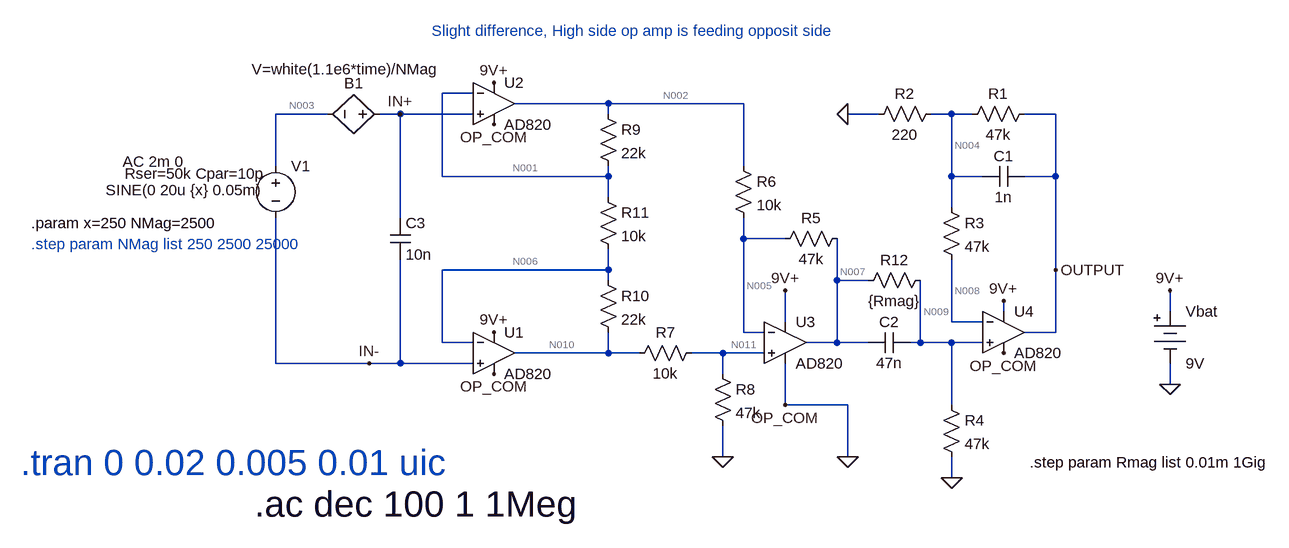
[diagram p0: schematic CornellBareReconstruction.asc]
CornellBareReconstruction.asc, the LTspice schematic file:
Version 4
SHEET 1 1252 680
WIRE -32 -384 -80 -384
WIRE 176 -368 32 -368
WIRE 384 -368 176 -368
WIRE -256 -352 -336 -352
WIRE -144 -352 -176 -352
WIRE -32 -352 -144 -352
WIRE 176 -352 176 -368
WIRE 592 -352 544 -352
WIRE 704 -352 672 -352
WIRE 736 -352 704 -352
WIRE 864 -352 816 -352
WIRE -336 -272 -336 -352
WIRE 384 -272 384 -368
WIRE -80 -256 -80 -384
WIRE 176 -256 176 -272
WIRE 176 -256 -80 -256
WIRE 704 -256 704 -352
WIRE 752 -256 704 -256
WIRE 864 -256 864 -352
WIRE 864 -256 816 -256
WIRE 176 -224 176 -256
WIRE 704 -208 704 -256
WIRE -144 -192 -144 -352
WIRE 384 -160 384 -192
WIRE 448 -160 384 -160
WIRE 176 -112 176 -144
WIRE 176 -112 -80 -112
WIRE 864 -112 864 -256
WIRE 176 -96 176 -112
WIRE 528 -96 528 -160
WIRE 576 -96 528 -96
WIRE 784 -48 784 -64
WIRE 1040 -48 1040 -80
WIRE 448 -32 448 -80
WIRE 704 -32 704 -128
WIRE 752 -32 704 -32
WIRE 384 -16 384 -160
WIRE 416 -16 384 -16
WIRE 864 -16 864 -112
WIRE 864 -16 816 -16
WIRE -80 0 -80 -112
WIRE -32 0 -80 0
WIRE 528 0 528 -96
WIRE 528 0 480 0
WIRE 576 0 528 0
WIRE 656 0 656 -96
WIRE 656 0 640 0
WIRE 704 0 656 0
WIRE 752 0 704 0
WIRE 176 16 176 -16
WIRE 176 16 32 16
WIRE 224 16 176 16
WIRE 352 16 304 16
WIRE 416 16 352 16
WIRE -336 32 -336 -192
WIRE -192 32 -336 32
WIRE -144 32 -144 -128
WIRE -144 32 -192 32
WIRE -32 32 -144 32
WIRE 352 48 352 16
WIRE 1040 64 1040 32
WIRE 448 96 448 32
WIRE 544 96 448 96
WIRE 704 96 704 0
WIRE 352 176 352 128
WIRE 544 176 544 96
WIRE 704 208 704 176
FLAG 544 -352 0
FLAG 704 208 0
FLAG 784 -64 9V+
FLAG 1040 64 0
FLAG 1040 -80 9V+
FLAG 448 96 OP_COM
FLAG 784 16 OP_COM
FLAG 448 -80 9V+
FLAG 352 176 0
FLAG 0 -400 9V+
FLAG 0 48 OP_COM
FLAG 0 -336 OP_COM
FLAG 0 -16 9V+
FLAG 864 -112 OUTPUT
FLAG 544 176 0
FLAG -144 -352 IN+
FLAG -192 32 IN-
SYMBOL OpAmps\\AD820 0 -48 R0
SYMATTR InstName U1
SYMBOL OpAmps\\AD820 0 -432 R0
SYMATTR InstName U2
SYMBOL OpAmps\\AD820 448 -64 R0
SYMATTR InstName U3
SYMBOL OpAmps\\AD820 784 -80 R0
SYMATTR InstName U4
SYMBOL res 832 -368 R90
WINDOW 0 0 56 VBottom 2
WINDOW 3 32 56 VTop 2
SYMATTR InstName R1
SYMATTR Value 47k
SYMBOL cap 816 -272 R90
WINDOW 0 0 32 VBottom 2
WINDOW 3 32 32 VTop 2
SYMATTR InstName C1
SYMATTR Value 1n
SYMBOL res 688 -368 R90
WINDOW 0 0 56 VBottom 2
WINDOW 3 32 56 VTop 2
SYMATTR InstName R2
SYMATTR Value 220
SYMBOL res 688 -224 R0
SYMATTR InstName R3
SYMATTR Value 47k
SYMBOL res 688 80 R0
SYMATTR InstName R4
SYMATTR Value 47k
SYMBOL cap 640 -16 R90
WINDOW 0 0 32 VBottom 2
WINDOW 3 32 32 VTop 2
SYMATTR InstName C2
SYMATTR Value 47n
SYMBOL Misc\\battery 1040 -64 R0
WINDOW 123 0 0 Left 0
WINDOW 39 0 0 Left 0
SYMATTR InstName Vbat
SYMATTR Value 9V
SYMBOL res 544 -176 R90
WINDOW 0 0 56 VBottom 2
WINDOW 3 32 56 VTop 2
SYMATTR InstName R5
SYMATTR Value 47k
SYMBOL res 368 -288 R0
SYMATTR InstName R6
SYMATTR Value 10k
SYMBOL res 320 0 R90
WINDOW 0 0 56 VBottom 2
WINDOW 3 32 56 VTop 2
SYMATTR InstName R7
SYMATTR Value 10k
SYMBOL res 336 32 R0
SYMATTR InstName R8
SYMATTR Value 47k
SYMBOL res 160 -112 R0
SYMATTR InstName R10
SYMATTR Value 22k
SYMBOL res 160 -240 R0
SYMATTR InstName R11
SYMATTR Value 10k
SYMBOL res 160 -368 R0
SYMATTR InstName R9
SYMATTR Value 22k
SYMBOL voltage -336 -288 R0
WINDOW 123 -235 9 Left 2
WINDOW 39 -232 28 Left 2
WINDOW 3 -261 53 Left 2
SYMATTR Value2 AC 2m 0
SYMATTR SpiceLine Rser=50k Cpar=10p
SYMATTR Value SINE(0 20u {x} 0.05m)
SYMATTR InstName V1
SYMBOL bv -160 -352 R90
WINDOW 0 -32 56 VBottom 2
WINDOW 3 -85 68 VTop 2
SYMATTR InstName B1
SYMATTR Value V=white(1.1e6*time)/NMag
SYMBOL cap -160 -192 R0
SYMATTR InstName C3
SYMATTR Value 10n
SYMBOL res 672 -112 R90
WINDOW 0 0 56 VBottom 2
WINDOW 3 32 56 VTop 2
SYMATTR InstName R12
SYMATTR Value {Rmag}
TEXT -96 -480 Left 2 ;Slight difference, High side op amp is feeding opposit side
TEXT -712 -184 Left 2 !.param x=250 NMag=2500
TEXT -368 248 Left 5 !.ac dec 100 1 1Meg
TEXT -728 184 Left 5 ;.tran 0 0.02 0.005 0.01 uic
TEXT -712 -152 Left 2 ;.step param NMag list 250 2500 25000
TEXT 824 184 Left 2 !.step param Rmag list 0.01m 1Gig

The netlist it stands for:
* CornellBareReconstruction.asc
XU1 IN- N006 9V+ 0 N010 AD820  ; pins In+ In- V+ V- OUT
XU2 IN+ N001 9V+ 0 N002 AD820  ; pins In+ In- V+ V- OUT
XU3 N011 N005 9V+ 0 N007 AD820  ; pins In+ In- V+ V- OUT
XU4 N009 N008 9V+ 0 OUTPUT AD820  ; pins In+ In- V+ V- OUT
R1 OUTPUT N004 47k
C1 OUTPUT N004 1n
R2 N004 0 220
R3 N004 N008 47k
R4 N009 0 47k
C2 N009 N007 47n
Vbat 9V+ 0 9V
R5 N007 N005 47k
R6 N002 N005 10k
R7 N011 N010 10k
R8 N011 0 47k
R10 N006 N010 22k
R11 N001 N006 10k
R9 N002 N001 22k
V1 N003 IN- SINE(0 20u {x} 0.05m) AC 2m 0 Rser=50k Cpar=10p
B1 IN+ N003 V=white(1.1e6*time)/NMag
C3 IN+ IN- 10n
R12 N009 N007 {Rmag}
* Slight difference, High side op amp is feeding opposit side
.param x=250 NMag=2500
.ac dec 100 1 1Meg
* .tran 0 0.02 0.005 0.01 uic
* .step param NMag list 250 2500 25000
.step param Rmag list 0.01m 1Gig
.backanno
.end

* Results of the author's LTspice run, read from the files saved beside the schematic
* Operating Point (first step), zero values left out:
*   rmag = 10 µ
*   V(9v+) = 9 V
*   V(n006) = 28.77 mV
*   V(in-) = 28.77 mV
*   V(n010) = 28.77 mV
*   V(n001) = 28.77 mV
*   V(in+) = 28.77 mV
*   V(n002) = 28.77 mV
*   V(n005) = 24.18 mV
*   V(n011) = 23.73 mV
*   V(n007) = 2.586 mV
*   V(n008) = 2.586 mV
*   V(n009) = 2.586 mV
*   V(output) = 555 mV
*   V(n004) = 2.586 mV
*   V(n003) = 28.77 mV
*   I(R1) = 11.75 µA
*   I(R2) = 11.75 µA
*   I(R4) = 55.02 nA
*   I(R5) = -459.4 nA
*   I(R6) = 459.4 nA
*   I(R7) = -504.8 nA
*   I(R8) = 504.8 nA
*   I(R12) = -55.02 nA
*   I(Vbat) = -2.825 mA
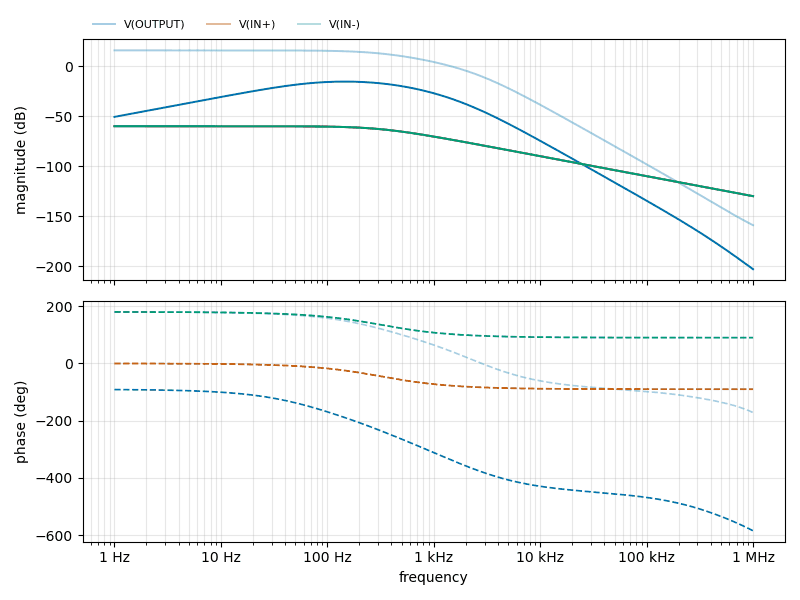
[diagram p1: AC Analysis of CornellBareReconstruction.asc, plotted from the saved traces]
* AC Analysis, 2 runs:
*   V(OUTPUT) [rmag=1e-05]: 15.81 dB at 1 Hz, -159.03 dB at 1 MHz, peak 15.81 dB at 1 Hz, 3 dB below the peak at 308.6 Hz
*   V(OUTPUT) [rmag=1e+09]: -50.68 dB at 1 Hz, -203.00 dB at 1 MHz, peak -15.39 dB at 147.9 Hz, 3 dB below the peak at 51.1 Hz and 399.8 Hz
*   V(IN+) [rmag=1e-05]: -60.00 dB at 1 Hz, -129.95 dB at 1 MHz, peak -60.00 dB at 1 Hz, 3 dB below the peak at 318 Hz
*   V(IN+) [rmag=1e+09]: -60.00 dB at 1 Hz, -129.95 dB at 1 MHz, peak -60.00 dB at 1 Hz, 3 dB below the peak at 318 Hz
*   V(IN-) [rmag=1e-05]: -60.00 dB at 1 Hz, -129.95 dB at 1 MHz, peak -60.00 dB at 1 Hz, 3 dB below the peak at 318 Hz
*   V(IN-) [rmag=1e+09]: -60.00 dB at 1 Hz, -129.95 dB at 1 MHz, peak -60.00 dB at 1 Hz, 3 dB below the peak at 318 Hz